# Altium schematic sheet Quectel_SA800U-WF_SCH_Part_AD_V1.1.SchDoc
size A1
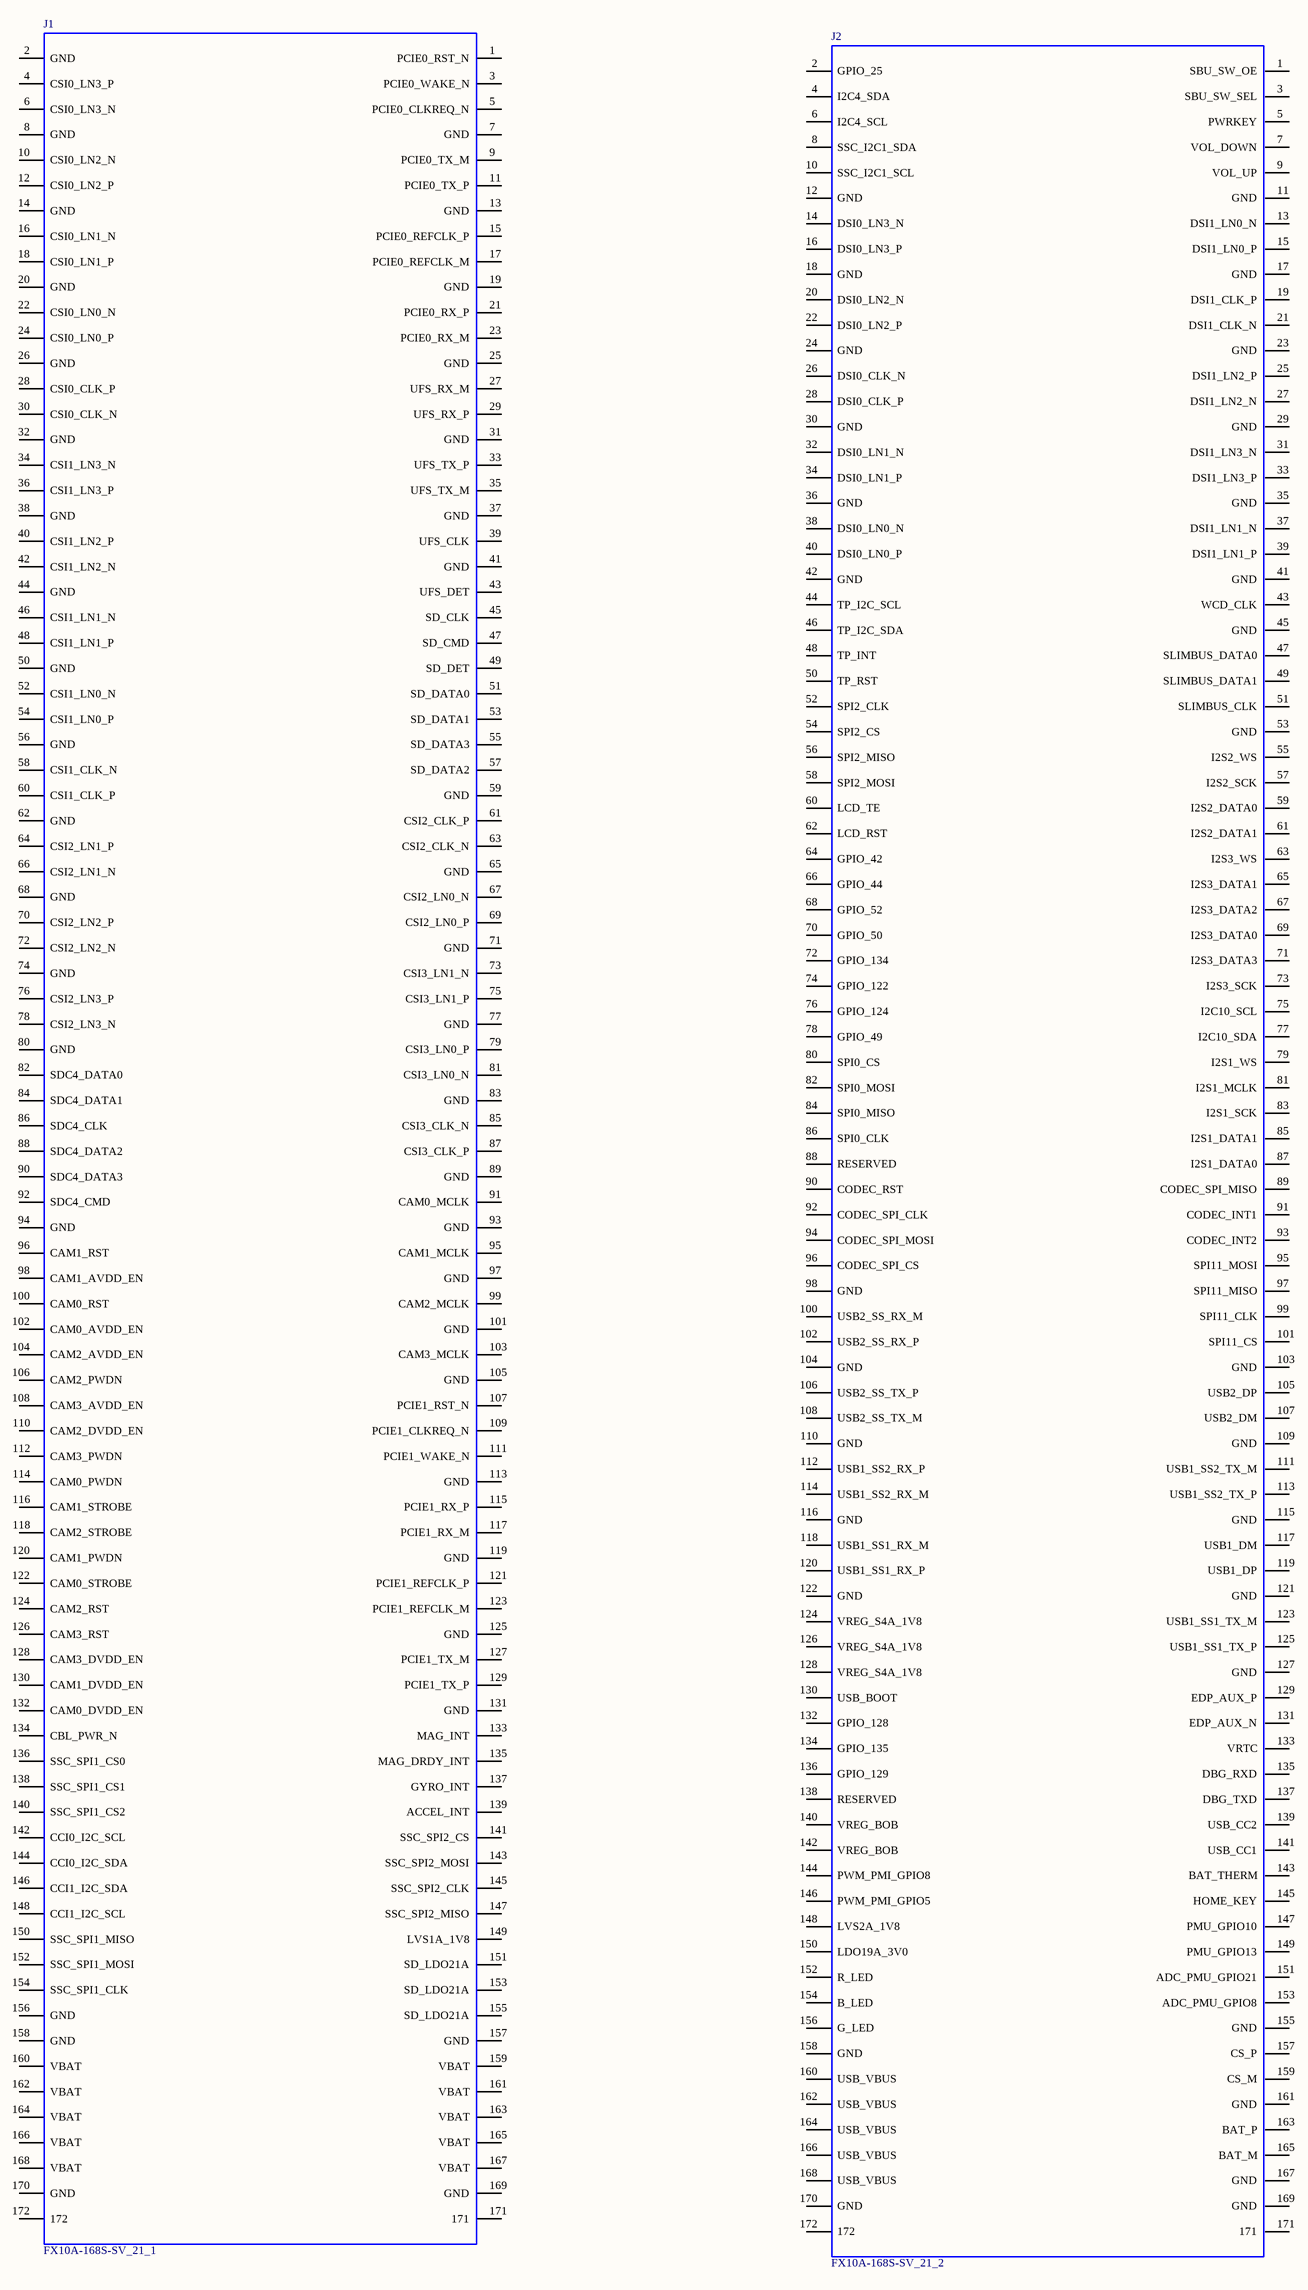
[diagram p0: Quectel_SA800U-WF_SCH_Part_AD_V1.1.SchDoc]

## Parts
J1  FX10A-168S-SV_21_1
J2  FX10A-168S-SV_21_2

## Nets

Not connected (* = marked no-connect by the designer): J1 1(PCIE0_RST_N) 2(GND) 3(PCIE0_WAKE_N) 4(CSI0_LN3_P) 5(PCIE0_CLKREQ_N) 6(CSI0_LN3_N) 7(GND) 8(GND) 9(PCIE0_TX_M) 10(CSI0_LN2_N) 11(PCIE0_TX_P) 12(CSI0_LN2_P) 13(GND) 14(GND) 15(PCIE0_REFCLK_P) 16(CSI0_LN1_N) 17(PCIE0_REFCLK_M) 18(CSI0_LN1_P) 19(GND) 20(GND) 21(PCIE0_RX_P) 22(CSI0_LN0_N) 23(PCIE0_RX_M) 24(CSI0_LN0_P) 25(GND) 26(GND) 27(UFS_RX_M) 28(CSI0_CLK_P) 29(UFS_RX_P) 30(CSI0_CLK_N) 31(GND) 32(GND) 33(UFS_TX_P) 34(CSI1_LN3_N) 35(UFS_TX_M) 36(CSI1_LN3_P) 37(GND) 38(GND) 39(UFS_CLK) 40(CSI1_LN2_P) 41(GND) 42(CSI1_LN2_N) 43(UFS_DET) 44(GND) 45(SD_CLK) 46(CSI1_LN1_N) 47(SD_CMD) 48(CSI1_LN1_P) 49(SD_DET) 50(GND) 51(SD_DATA0) 52(CSI1_LN0_N) 53(SD_DATA1) 54(CSI1_LN0_P) 55(SD_DATA3) 56(GND) 57(SD_DATA2) 58(CSI1_CLK_N) 59(GND) 60(CSI1_CLK_P) 61(CSI2_CLK_P) 62(GND) 63(CSI2_CLK_N) 64(CSI2_LN1_P) 65(GND) 66(CSI2_LN1_N) 67(CSI2_LN0_N) 68(GND) 69(CSI2_LN0_P) 70(CSI2_LN2_P) 71(GND) 72(CSI2_LN2_N) 73(CSI3_LN1_N) 74(GND) 75(CSI3_LN1_P) 76(CSI2_LN3_P) 77(GND) 78(CSI2_LN3_N) 79(CSI3_LN0_P) 80(GND) 81(CSI3_LN0_N) 82(SDC4_DATA0) 83(GND) 84(SDC4_DATA1) 85(CSI3_CLK_N) 86(SDC4_CLK) 87(CSI3_CLK_P) 88(SDC4_DATA2) 89(GND) 90(SDC4_DATA3) 91(CAM0_MCLK) 92(SDC4_CMD) 93(GND) 94(GND) 95(CAM1_MCLK) 96(CAM1_RST) 97(GND) 98(CAM1_AVDD_EN) 99(CAM2_MCLK) 100(CAM0_RST) 101(GND) 102(CAM0_AVDD_EN) 103(CAM3_MCLK) 104(CAM2_AVDD_EN) 105(GND) 106(CAM2_PWDN) 107(PCIE1_RST_N) 108(CAM3_AVDD_EN) 109(PCIE1_CLKREQ_N) 110(CAM2_DVDD_EN) 111(PCIE1_WAKE_N) 112(CAM3_PWDN) 113(GND) 114(CAM0_PWDN) 115(PCIE1_RX_P) 116(CAM1_STROBE) 117(PCIE1_RX_M) 118(CAM2_STROBE) 119(GND) 120(CAM1_PWDN) 121(PCIE1_REFCLK_P) 122(CAM0_STROBE) 123(PCIE1_REFCLK_M) 124(CAM2_RST) 125(GND) 126(CAM3_RST) 127(PCIE1_TX_M) 128(CAM3_DVDD_EN) 129(PCIE1_TX_P) 130(CAM1_DVDD_EN) 131(GND) 132(CAM0_DVDD_EN) 133(MAG_INT) 134(CBL_PWR_N) 135(MAG_DRDY_INT) 136(SSC_SPI1_CS0) 137(GYRO_INT) 138(SSC_SPI1_CS1) 139(ACCEL_INT) 140(SSC_SPI1_CS2) 141(SSC_SPI2_CS) 142(CCI0_I2C_SCL) 143(SSC_SPI2_MOSI) 144(CCI0_I2C_SDA) 145(SSC_SPI2_CLK) 146(CCI1_I2C_SDA) 147(SSC_SPI2_MISO) 148(CCI1_I2C_SCL) 149(LVS1A_1V8) 150(SSC_SPI1_MISO) 151(SD_LDO21A) 152(SSC_SPI1_MOSI) 153(SD_LDO21A) 154(SSC_SPI1_CLK) 155(SD_LDO21A) 156(GND) 157(GND) 158(GND) 159(VBAT) 160(VBAT) 161(VBAT) 162(VBAT) 163(VBAT) 164(VBAT) 165(VBAT) 166(VBAT) 167(VBAT) 168(VBAT) 169(GND) 170(GND) 171 172; J2 1(SBU_SW_OE) 2(GPIO_25) 3(SBU_SW_SEL) 4(I2C4_SDA) 5(PWRKEY) 6(I2C4_SCL) 7(VOL_DOWN) 8(SSC_I2C1_SDA) 9(VOL_UP) 10(SSC_I2C1_SCL) 11(GND) 12(GND) 13(DSI1_LN0_N) 14(DSI0_LN3_N) 15(DSI1_LN0_P) 16(DSI0_LN3_P) 17(GND) 18(GND) 19(DSI1_CLK_P) 20(DSI0_LN2_N) 21(DSI1_CLK_N) 22(DSI0_LN2_P) 23(GND) 24(GND) 25(DSI1_LN2_P) 26(DSI0_CLK_N) 27(DSI1_LN2_N) 28(DSI0_CLK_P) 29(GND) 30(GND) 31(DSI1_LN3_N) 32(DSI0_LN1_N) 33(DSI1_LN3_P) 34(DSI0_LN1_P) 35(GND) 36(GND) 37(DSI1_LN1_N) 38(DSI0_LN0_N) 39(DSI1_LN1_P) 40(DSI0_LN0_P) 41(GND) 42(GND) 43(WCD_CLK) 44(TP_I2C_SCL) 45(GND) 46(TP_I2C_SDA) 47(SLIMBUS_DATA0) 48(TP_INT) 49(SLIMBUS_DATA1) 50(TP_RST) 51(SLIMBUS_CLK) 52(SPI2_CLK) 53(GND) 54(SPI2_CS) 55(I2S2_WS) 56(SPI2_MISO) 57(I2S2_SCK) 58(SPI2_MOSI) 59(I2S2_DATA0) 60(LCD_TE) 61(I2S2_DATA1) 62(LCD_RST) 63(I2S3_WS) 64(GPIO_42) 65(I2S3_DATA1) 66(GPIO_44) 67(I2S3_DATA2) 68(GPIO_52) 69(I2S3_DATA0) 70(GPIO_50) 71(I2S3_DATA3) 72(GPIO_134) 73(I2S3_SCK) 74(GPIO_122) 75(I2C10_SCL) 76(GPIO_124) 77(I2C10_SDA) 78(GPIO_49) 79(I2S1_WS) 80(SPI0_CS) 81(I2S1_MCLK) 82(SPI0_MOSI) 83(I2S1_SCK) 84(SPI0_MISO) 85(I2S1_DATA1) 86(SPI0_CLK) 87(I2S1_DATA0) 88(RESERVED) 89(CODEC_SPI_MISO) 90(CODEC_RST) 91(CODEC_INT1) 92(CODEC_SPI_CLK) 93(CODEC_INT2) 94(CODEC_SPI_MOSI) 95(SPI11_MOSI) 96(CODEC_SPI_CS) 97(SPI11_MISO) 98(GND) 99(SPI11_CLK) 100(USB2_SS_RX_M) 101(SPI11_CS) 102(USB2_SS_RX_P) 103(GND) 104(GND) 105(USB2_DP) 106(USB2_SS_TX_P) 107(USB2_DM) 108(USB2_SS_TX_M) 109(GND) 110(GND) 111(USB1_SS2_TX_M) 112(USB1_SS2_RX_P) 113(USB1_SS2_TX_P) 114(USB1_SS2_RX_M) 115(GND) 116(GND) 117(USB1_DM) 118(USB1_SS1_RX_M) 119(USB1_DP) 120(USB1_SS1_RX_P) 121(GND) 122(GND) 123(USB1_SS1_TX_M) 124(VREG_S4A_1V8) 125(USB1_SS1_TX_P) 126(VREG_S4A_1V8) 127(GND) 128(VREG_S4A_1V8) 129(EDP_AUX_P) 130(USB_BOOT) 131(EDP_AUX_N) 132(GPIO_128) 133(VRTC) 134(GPIO_135) 135(DBG_RXD) 136(GPIO_129) 137(DBG_TXD) 138(RESERVED) 139(USB_CC2) 140(VREG_BOB) 141(USB_CC1) 142(VREG_BOB) 143(BAT_THERM) 144(PWM_PMI_GPIO8) 145(HOME_KEY) 146(PWM_PMI_GPIO5) 147(PMU_GPIO10) 148(LVS2A_1V8) 149(PMU_GPIO13) 150(LDO19A_3V0) 151(ADC_PMU_GPIO21) 152(R_LED) 153(ADC_PMU_GPIO8) 154(B_LED) 155(GND) 156(G_LED) 157(CS_P) 158(GND) 159(CS_M) 160(USB_VBUS) 161(GND) 162(USB_VBUS) 163(BAT_P) 164(USB_VBUS) 165(BAT_M) 166(USB_VBUS) 167(GND) 168(USB_VBUS) 169(GND) 170(GND) 171 172

## Library data of the parts
J1 = FX10A-168S-SV_21_1: BOMRemark: *; Geometry.Height: *; Manufacturer: *; option: *; Part Description: *; Part Number: *; Value: *; PCB DECAL: *
J2 = FX10A-168S-SV_21_2: BOMRemark: *; Geometry.Height: *; Manufacturer: *; option: *; Part Description: *; Part Number: *; Value: *; PCB DECAL: *